# Altium project BEAGLEBONEBLACK.PrjPcb (part 6 of 6)

## Sheet USB_Host.SchDoc
size Letter
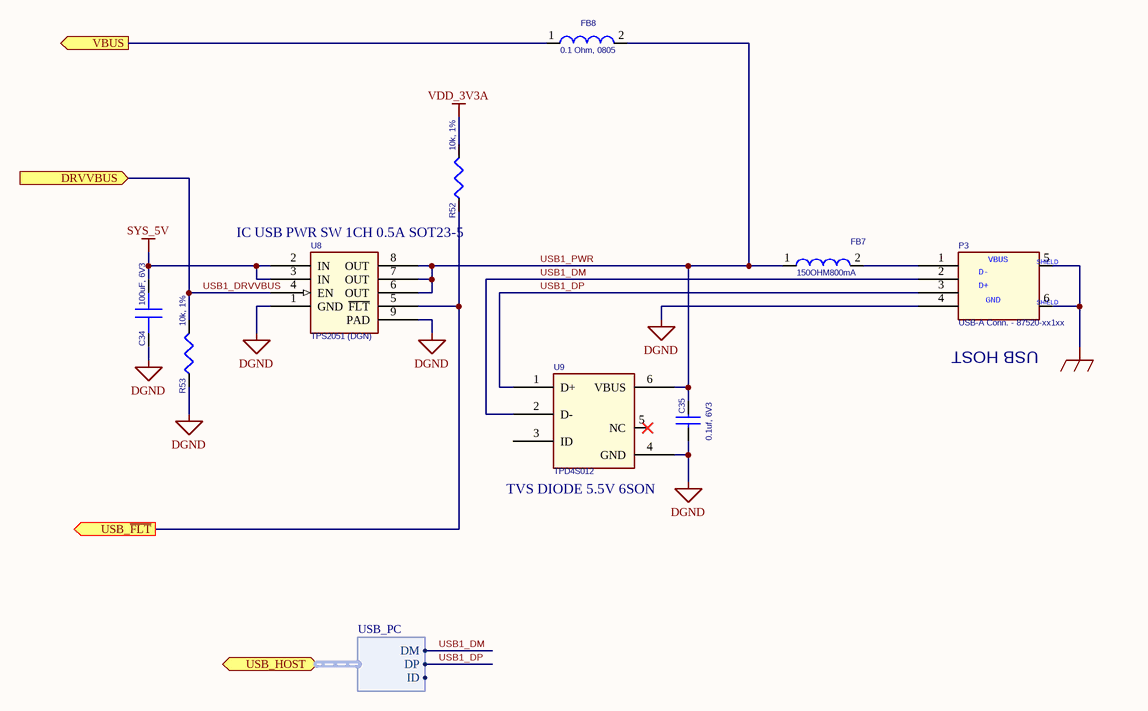
[diagram p19: USB_Host.SchDoc]

### Parts
C34  100uF, 6V3  [RD205SMD_250D]
C35  0.1uf, 6V3  [402]
FB7  150OHM800mA  [SM-7351-IND-0805]
FB8  0.1 Ohm, 0805  [SM-7351-IND-0805]
P3  USB-A Conn. - 87520-xx1xx  [usb_a_sh]
R52  10k, 1%  [402]
R53  10k, 1%  [402]
U8  TPS2051 (DGN)  [DGN-16X60]
U9  TPD4S012  [U_6_DRY]

### Ports
DRVVBUS (in), USB_HOST (harness USB_PC), USB_~{FLT} (out), VBUS (out)

### Harnesses
USB_PC: DM, DP, ID

### Nets
DGND: C34.2 C35.2 P3.4(P4) R53.2(P2) U8.1(GND) U8.9(PAD) U9.4(GND)
GND_EARTH: P3.5(SHELD1) P3.6(PAD4)
SYS_5V: C34.1 U8.2(IN) U8.3(IN)
VDD_3V3A: R52.1(P1)
USB1_DM: P3.2(P2) U9.2(D-) ; port USB_HOST.DM
USB1_DP: P3.3(P3) U9.1(D+) ; port USB_HOST.DP
USB1_DRVVBUS: R53.1(P1) U8.4(EN) ; port DRVVBUS
USB1_PWR: C35.1 FB7.1 FB8.2 U8.6(OUT) U8.7(OUT) U8.8(OUT) U9.6(VBUS)
USB1_VBUS: FB8.1 ; port VBUS
USB_~{FLT}: R52.2(P2) U8.5(~{FLT}) ; port USB_~{FLT}
NetFB7_2: FB7.2 P3.1(P1)

Not connected (* = marked no-connect by the designer): U9 3(ID) 5(NC)*

### Notes on the sheet
- IC USB PWR SW 1CH 0.5A SOT23-5
- (near P3) USB HOST
- (near U9) TVS DIODE 5.5V 6SON
- (in symbol CONN_54819-0578_2) VBUS; SHIELD; D-; D+; GND

### Library data of the parts
C34 = CAP SMD: CAP ALUM 100UF 6.3V 20% SMD; Manufacturer: Cornell Dubilier Electronics (CDE); Manufacturer Part Number: AVE107M06D16T-F; Capacitance: 100µF; Lifetime @ Temp.: 2000 Hrs @ 85°C; Ripple Current: 120mA; ESR (Equivalent Series Resistance): 4.64 Ohm; Surface Mount Land Size: 0.260" L x 0.260" W (6.60mm x 6.60mm); Supplier 1: Digi-Key; Supplier Part Number 1: 338-1787-6-ND; RoHS: RoHS Compliant; Category: Capacitors; Stock 1: 2601; Pricing 1: 1=0.17, 10=0.16, 100=0.133, 250=0.11844, 500=0.0987 (USD); Voltage Rating: 6.3V; Tolerance: ±20%; Operating Temperature: -40°C ~ 85°C; Features: General Purpose; Impedance: -; Mounting Type: Surface Mount; Package / Case: Radial, Can - SMD; Size / Dimension: 0.248" Dia (6.30mm); Height - Seated (Max): 0.209" (5.30mm); Lead Spacing: -; Packaging: Digi-Reel®; ComponentLink1URL: http://www.cde.com/catalogs/AVE.pdf; ComponentLink1Description: http://www.cde.com/catalogs/AVE.pdf
C35 = CAP_0.1uF_X7R_16V_10% 0402: CAP CER 0.1UF 6.3V 10% X5R 0402; Manufacturer: TDK Corporation; Manufacturer Part Number: C1005X5R0J104K050BA; Capacitance: 0.1µF; Supplier 1: Digi-Key; Supplier Part Number 1: 445-1266-6-ND; RoHS: RoHS Compliant; Category: Capacitors; Stock 1: 127604; Pricing 1: 1=0.1, 10=0.026, 100=0.0121, 250=0.00992, 500=0.00848, 1000=0.0066, 5000=0.0055 (USD); Voltage - Rated: 6.3V; Tolerance: ±10%; Temperature Coefficient: X5R; Mounting Type: Surface Mount, MLCC; Operating Temperature: -55°C ~ 85°C; Applications: General Purpose; Ratings: -; Package / Case: 0402 (1005 Metric); Size / Dimension: 0.039" L x 0.020" W (1.00mm x 0.50mm); Height - Seated (Max): -; Thickness (Max): 0.022" (0.55mm); Lead Spacing: -; Features: -; Packaging: Digi-Reel®; Lead Style: -; ComponentLink1URL: http://product.tdk.com/capacitor/mlcc/en/documents/mlcc_commercial_general_en.pdf; ComponentLink1Description: http://product.tdk.com/capacitor/mlcc/en/documents/mlcc_commercial_general_en.pdf
FB7 = FER_180_200_0: FERRITE 800MA 150 OHM 0805 SMD; PartName: FerriteBead150ohm800mA; Mfr: Steward; MfrNum: LI0805H151R-10; TIIntPartnumber: 1L0010; Manufacturer: Laird-Signal Integrity Products; Vendor: Digikey; Impedance @ Frequency: 150 Ohm @ 100MHz; DC Resistance (DCR): 150 mOhm Max; Filter Type: Differential Mode - Single; Supplier 1: Digi-Key; Supplier Part Number 1: 240-2384-6-ND; Manufacturer Part Number: LI0805H151R-10; RoHS: RoHS Compliant; Category: Filters; Stock 1: 3694; Pricing 1: 1=0.1, 10=0.07, 25=0.064, 50=0.0574, 100=0.0421, 250=0.03064, 500=0.02808, 1000=0.02424 (USD); Current Rating: 800mA; Package / Case: 0805 (2012 Metric); Mounting Type: Surface Mount; Packaging: Digi-Reel®; Height (Max): 0.043" (1.10mm); Size / Dimension: 0.079" L x 0.049" W (2.00mm x 1.25mm); ComponentLink1URL: http://www.lairdtech.com/WorkArea/linkit.aspx?LinkIdentifier=id&ItemID=4912; ComponentLink1Description: http://www.lairdtech.com/WorkArea/linkit.aspx?LinkIdentifier=id&ItemID=4912
FB8 = FER_180_200_0: RES .10 OHM 1/8W 5% 0805; Manufacturer: CTS Resistor Products; Manufacturer Part Number: 73L3R10J; Resistance (Ohms): 0.1; Power (Watts): 0.125W, 1/8W; Temperature Coefficient: ±200ppm/°C; Supplier 1: Digi-Key; Supplier Part Number 1: 73L3R10JDKR-ND; RoHS: RoHS Compliant; Category: Resistors; Stock 1: 1186; Pricing 1: 1=0.1, 10=0.066, 100=0.0267, 250=0.0204, 500=0.01632, 1000=0.01201 (USD); Composition: Thick Film; Features: Current Sense; Tolerance: ±5%; Package / Case: 0805 (2012 Metric); Supplier Device Package: 0805; Size / Dimension: 0.079" L x 0.049" W (2.00mm x 1.25mm); Height: 0.026" (0.65mm); Number of Terminations: 2; Packaging: Digi-Reel®; ComponentLink1URL: http://www.ctscorp.com/components/Datasheets/008-0337-0.pdf; ComponentLink1Description: http://www.ctscorp.com/components/Datasheets/008-0337-0.pdf
P3 = CONN_54819-0578_2: CONN RCPT USB TYPE A R/A PCB; Manufacturer: FCI; Manufacturer Part Number: 87520-0010BLF; CLASS: IO; TN: 224-0234-000; Number of Contacts: 4; Gender: Receptacle; Specifications: USB 2.0; Supplier 1: Digi-Key; Supplier Part Number 1: 609-1045-ND; RoHS: RoHS Compliant; Category: Connectors, Interconnects; Stock 1: 4363; Pricing 1: 1=0.78, 10=0.734, 25=0.6604, 50=0.587, 100=0.5626, 250=0.51368, 500=0.4892, 1000=0.40359, 2500=0.3669 (USD); Connector Type: USB - A; Mounting Type: Through Hole, Right Angle, Horizontal; Features: Board Lock; Packaging: Tube; Ingress Protection: -; ComponentLink1URL: http://portal.fciconnect.com/Comergent//fci/drawing/87520.pdf; ComponentLink1Description: http://portal.fciconnect.com/Comergent//fci/drawing/87520.pdf
R52 R53 = RES SMD: RES 10K OHM 1/16W 5% 0402 SMD; Manufacturer: Rohm Semiconductor; Manufacturer Part Number: MCR01MZPJ103; Power (Watts): 0.063W, 1/16W; Temperature Coefficient: ±200ppm/°C; Supplier 1: Digi-Key; Supplier Part Number 1: RHM10KJDKR-ND; RoHS: RoHS Compliant; Category: Resistors; Stock 1: 452072; Pricing 1: 1=0.1, 10=0.019, 25=0.014, 100=0.0078, 250=0.00596, 500=0.00476, 1000=0.0035, 5000=0.00251 (USD); Resistance (Ohms): 10k; Composition: Thick Film; Features: Automotive AEC-Q200 Qualified; Tolerance: ±5%; Package / Case: 0402 (1005 Metric); Supplier Device Package: 0402 (1005 Metric); Size / Dimension: 0.039" L x 0.020" W (1.00mm x 0.50mm); Height: 0.016" (0.40mm); Number of Terminations: 2; Packaging: Digi-Reel®; ComponentLink1URL: http://rohmfs.rohm.com/en/products/databook/datasheet/passive/resistor/chip_resistor/mcr_a.pdf; ComponentLink1Description: http://rohmfs.rohm.com/en/products/databook/datasheet/passive/resistor/chip_resistor/mcr_a.pdf
U8 = TPS2061_0: IC 1.5A PWR DIST SWITCH 8-SOIC; Manufacturer: Texas Instruments; Manufacturer Part Number: TPS2051BDGNR; Number of Outputs: 1; Rds (On): 135 mOhm; Internal Switch(s): Yes; Current Limit: 1A; Voltage - Input: 2.7 V ~ 5.5 V; Supplier 1: Digi-Key; Supplier Part Number 1: 296-17313-6-ND; RoHS: RoHS Compliant; Category: Integrated Circuits (ICs); Stock 1: 7065; Pricing 1: 1=1.82, 10=1.642, 25=1.4708, 100=1.3224, 250=1.1742, 500=1.026, 1000=0.8493 (USD); Type: High Side Switch; Operating Temperature: -40°C ~ 85°C; Mounting Type: Surface Mount; Package / Case: 8-TSSOP, 8-MSOP (0.118", 3.00mm Width) Exposed Pad; Supplier Device Package: 8-MSOP-PowerPad; Packaging: Digi-Reel®; ComponentLink1URL: http://www.ti.com/lit/ds/symlink/tps2051b.pdf; ComponentLink1Description: http://www.ti.com/lit/ds/symlink/tps2051b.pdf
U9 = PROT_TPD4S012: ESD 4channel USB Interface; Mfr: TI; MfrNum: TPD4S012DRY; TIIntPartnumber: 1A0233; Manufacturer: Texas Instruments; Manufacturer Part Number: TPD4S012DRYR; Vendor: Digikey; Cost100: 0.76; Cost10K: 0.23; Power (Watts): 60W; Number of Circuits: 4; PartName: TPD4S012; Supplier 1: Digi-Key; Supplier Part Number 1: 296-24244-6-ND; RoHS: RoHS Compliant; Category: Circuit Protection; Stock 1: 7978; Pricing 1: 1=0.78, 10=0.682, 25=0.6028, 100=0.2552, 250=0.25044, 500=0.2457, 750=0.24097 (USD); Voltage - Working: -; Voltage - Clamping: -; Technology: Mixed Technology; Applications: USB; Package / Case: 6-UFDFN; Supplier Device Package: 6-SON (1.45x1); Packaging: Digi-Reel®; ComponentLink1URL: http://www.ti.com/lit/ds/symlink/tpd4s012.pdf; ComponentLink1Description: http://www.ti.com/lit/ds/symlink/tpd4s012.pdf

## Nets that join several sheets
DDR_VREF: P07_DDR3 Memory (6 pins), P03_Processor 1 of 3, JTAG Header (C28.1 U5.J4)
DGND: Top (S1.1 S1.3 S3.1 S3.3), P02_Power Management (30 pins), P07_DDR3 Memory (42 pins), P10_HDMI Framer (47 pins), P04_Processor 2 or 3, USB and Serial (R49.1 R164.2), P03_Processor 1 of 3, JTAG Header (21 pins), P05_Processor Page 3 of 3 (111 pins), P06_LED, Config, & Button (26 pins), P08_eMMC (15 pins), P09_Ethernet (27 pins), P11_Exp Conn, uSD, and  (8 pins), U_Console (5 pins), SDCARD (C153.2 C154.2 P10.6 P10.9), BoardID (C152.2 U7.2), USB_PC (C36.2 P4.5 U10.4), USB_Host (7 pins)
GND_EARTH: P02_Power Management (MTG1.1 MTG2.1 MTG3.1 MTG4.1), P10_HDMI Framer (P6.20 P6.21 P6.22 P6.23), P09_Ethernet (P5.13 P5.14 R136.2), SDCARD (6 pins), USB_PC (P4.6 P4.7 P4.8 P4.9), USB_Host (P3.5 P3.6)
GNDA_ADC: P04_Processor 2 or 3, USB and Serial (C31.2 C32.2 C33.2 U5.A9), P05_Processor Page 3 of 3 (C93.2 FB3.1 U5.E8), P11_Exp Conn, uSD, and  (P9.34)
SYS_5V: P02_Power Management (14 pins), P10_HDMI Framer (RT1.1), P06_LED, Config, & Button (R71.1 R72.1 R73.1 R74.1), P11_Exp Conn, uSD, and  (P9.7 P9.8), USB_Host (C34.1 U8.2 U8.3)
VDD_1V8: P02_Power Management (C14.2 R9.2 U2.40), P10_HDMI Framer (FB5.2), P05_Processor Page 3 of 3 (9 pins)
VDD_3V3A: P02_Power Management (6 pins), P03_Processor 1 of 3, JTAG Header (9 pins), P05_Processor Page 3 of 3 (42 pins), P06_LED, Config, & Button (16 pins), P09_Ethernet (C5.1 U1.5), U_Console (R2.1 R13.1 R15.1), BoardID (C152.1 R156.1 U7.4), USB_Host (R52.1)
VDD_3V3B: P02_Power Management (C20.1 R11.1 U4.3), P10_HDMI Framer (R158.1 R166.2), P04_Processor 2 or 3, USB and Serial (R163.1), P03_Processor 1 of 3, JTAG Header (C29.1 P2.5 R23.1 R24.1), P08_eMMC (25 pins), P09_Ethernet (7 pins), P11_Exp Conn, uSD, and  (P9.3 P9.4), U_Console (C6.2 C155.2 U15.5 U17.5), SDCARD (10 pins)
VDD_5V: P02_Power Management (C2.2 P1.1 U2.10), P11_Exp Conn, uSD, and  (P9.5 P9.6)
VDD_ADC: P04_Processor 2 or 3, USB and Serial (R27.1), P05_Processor Page 3 of 3 (C93.1 FB2.1 U5.D8), P11_Exp Conn, uSD, and  (P9.32)
VDD_CORE: P02_Power Management (C11.2 L3.2 U2.29), P05_Processor Page 3 of 3 (37 pins)
VDD_MPU: P02_Power Management (C12.2 L2.2 U2.24), P05_Processor Page 3 of 3 (11 pins)
VDDS: P02_Power Management (R8.2 R9.1), P05_Processor Page 3 of 3 (13 pins)
VDDS_DDR: P02_Power Management (C9.2 R6.2), P07_DDR3 Memory (36 pins), P05_Processor Page 3 of 3 (16 pins)
VIO: P02_Power Management (R7.2 U2.18), P03_Processor 1 of 3, JTAG Header (U16.5)
VRTC: P02_Power Management (C16.1 R5.2), P04_Processor 2 or 3, USB and Serial (R26.1), P05_Processor Page 3 of 3 (C105.1 U5.D7)
12MHZ: P10_HDMI Framer (U11.27), P03_Processor 1 of 3, JTAG Header (R21.2)
AIN0: P04_Processor 2 or 3, USB and Serial (U5.B6), P11_Exp Conn, uSD, and  (P9.39)
AIN1: P04_Processor 2 or 3, USB and Serial (U5.C7), P11_Exp Conn, uSD, and  (P9.40)
AIN2: P04_Processor 2 or 3, USB and Serial (U5.B7), P11_Exp Conn, uSD, and  (P9.37)
AIN3: P04_Processor 2 or 3, USB and Serial (U5.A7), P11_Exp Conn, uSD, and  (P9.38)
AIN4: P04_Processor 2 or 3, USB and Serial (U5.C8), P11_Exp Conn, uSD, and  (P9.33)
AIN5: P04_Processor 2 or 3, USB and Serial (U5.B8), P11_Exp Conn, uSD, and  (P9.36)
AIN6: P04_Processor 2 or 3, USB and Serial (U5.A8), P11_Exp Conn, uSD, and  (P9.35)
DDR_A0: P07_DDR3 Memory (U12.N3), P03_Processor 1 of 3, JTAG Header (U5.F3)
DDR_A1: P07_DDR3 Memory (U12.P7), P03_Processor 1 of 3, JTAG Header (U5.H1)
DDR_A2: P07_DDR3 Memory (U12.P3), P03_Processor 1 of 3, JTAG Header (U5.E4)
DDR_A3: P07_DDR3 Memory (U12.N2), P03_Processor 1 of 3, JTAG Header (U5.C3)
DDR_A4: P07_DDR3 Memory (U12.P8), P03_Processor 1 of 3, JTAG Header (U5.C2)
DDR_A5: P07_DDR3 Memory (U12.P2), P03_Processor 1 of 3, JTAG Header (U5.B1)
DDR_A6: P07_DDR3 Memory (U12.R8), P03_Processor 1 of 3, JTAG Header (U5.D5)
DDR_A7: P07_DDR3 Memory (U12.R2), P03_Processor 1 of 3, JTAG Header (U5.E2)
DDR_A8: P07_DDR3 Memory (U12.T8), P03_Processor 1 of 3, JTAG Header (U5.D4)
DDR_A9: P07_DDR3 Memory (U12.R3), P03_Processor 1 of 3, JTAG Header (U5.C1)
DDR_A10: P07_DDR3 Memory (U12.L7), P03_Processor 1 of 3, JTAG Header (U5.F4)
DDR_A11: P07_DDR3 Memory (U12.R7), P03_Processor 1 of 3, JTAG Header (U5.F2)
DDR_A12: P07_DDR3 Memory (U12.N7), P03_Processor 1 of 3, JTAG Header (U5.E3)
DDR_A13: P07_DDR3 Memory (U12.T3), P03_Processor 1 of 3, JTAG Header (U5.H3)
DDR_A14: P07_DDR3 Memory (U12.T7), P03_Processor 1 of 3, JTAG Header (U5.H4)
DDR_A15: P07_DDR3 Memory (U12.M7), P03_Processor 1 of 3, JTAG Header (U5.D3)
DDR_BA0: P07_DDR3 Memory (U12.M2), P03_Processor 1 of 3, JTAG Header (U5.C4)
DDR_BA1: P07_DDR3 Memory (U12.N8), P03_Processor 1 of 3, JTAG Header (U5.E1)
DDR_BA2: P07_DDR3 Memory (U12.M3), P03_Processor 1 of 3, JTAG Header (U5.B3)
DDR_CASn: P07_DDR3 Memory (U12.K3), P03_Processor 1 of 3, JTAG Header (U5.F1)
DDR_CKE: P07_DDR3 Memory (R96.2 U12.K9), P03_Processor 1 of 3, JTAG Header (U5.G3)
DDR_CLK: P07_DDR3 Memory (U12.J7), P03_Processor 1 of 3, JTAG Header (U5.D2)
DDR_CLKn: P07_DDR3 Memory (U12.K7), P03_Processor 1 of 3, JTAG Header (U5.D1)
DDR_CSn: P07_DDR3 Memory (U12.L2), P03_Processor 1 of 3, JTAG Header (U5.H2)
DDR_D0: P07_DDR3 Memory (U12.E3), P03_Processor 1 of 3, JTAG Header (U5.M3)
DDR_D1: P07_DDR3 Memory (U12.F7), P03_Processor 1 of 3, JTAG Header (U5.M4)
DDR_D2: P07_DDR3 Memory (U12.F2), P03_Processor 1 of 3, JTAG Header (U5.N1)
DDR_D3: P07_DDR3 Memory (U12.F8), P03_Processor 1 of 3, JTAG Header (U5.N2)
DDR_D4: P07_DDR3 Memory (U12.H3), P03_Processor 1 of 3, JTAG Header (U5.N3)
DDR_D5: P07_DDR3 Memory (U12.H8), P03_Processor 1 of 3, JTAG Header (U5.N4)
DDR_D6: P07_DDR3 Memory (U12.G2), P03_Processor 1 of 3, JTAG Header (U5.P3)
DDR_D7: P07_DDR3 Memory (U12.H7), P03_Processor 1 of 3, JTAG Header (U5.P4)
DDR_D8: P07_DDR3 Memory (U12.D7), P03_Processor 1 of 3, JTAG Header (U5.J1)
DDR_D9: P07_DDR3 Memory (U12.C3), P03_Processor 1 of 3, JTAG Header (U5.K1)
DDR_D10: P07_DDR3 Memory (U12.C8), P03_Processor 1 of 3, JTAG Header (U5.K2)
DDR_D11: P07_DDR3 Memory (U12.C2), P03_Processor 1 of 3, JTAG Header (U5.K3)
DDR_D12: P07_DDR3 Memory (U12.A7), P03_Processor 1 of 3, JTAG Header (U5.K4)
DDR_D13: P07_DDR3 Memory (U12.A2), P03_Processor 1 of 3, JTAG Header (U5.L3)
DDR_D14: P07_DDR3 Memory (U12.B8), P03_Processor 1 of 3, JTAG Header (U5.L4)
DDR_D15: P07_DDR3 Memory (U12.A3), P03_Processor 1 of 3, JTAG Header (U5.M1)
DDR_DQM0: P07_DDR3 Memory (U12.E7), P03_Processor 1 of 3, JTAG Header (U5.M2)
DDR_DQM1: P07_DDR3 Memory (U12.D3), P03_Processor 1 of 3, JTAG Header (U5.J2)
DDR_DQS0: P07_DDR3 Memory (U12.F3), P03_Processor 1 of 3, JTAG Header (U5.P1)
DDR_DQS1: P07_DDR3 Memory (U12.C7), P03_Processor 1 of 3, JTAG Header (U5.L1)
DDR_DQSN0: P07_DDR3 Memory (U12.G3), P03_Processor 1 of 3, JTAG Header (U5.P2)
DDR_DQSN1: P07_DDR3 Memory (U12.B7), P03_Processor 1 of 3, JTAG Header (U5.L2)
DDR_ODT: P07_DDR3 Memory (U12.K1), P03_Processor 1 of 3, JTAG Header (U5.G1)
DDR_RASn: P07_DDR3 Memory (U12.J3), P03_Processor 1 of 3, JTAG Header (U5.G4)
DDR_RESETn: P07_DDR3 Memory (R97.2 U12.T2), P03_Processor 1 of 3, JTAG Header (U5.G2)
DDR_WEn: P07_DDR3 Memory (U12.L3), P03_Processor 1 of 3, JTAG Header (U5.B2)
eMMC_RSTn: P03_Processor 1 of 3, JTAG Header (R162.2), P08_eMMC (R111.2 U13.K5)
GPIO0_7: P04_Processor 2 or 3, USB and Serial (R50.1 R51.1), P11_Exp Conn, uSD, and  (P9.42)
GPIO0_22/EHRPWM2A: P03_Processor 1 of 3, JTAG Header (U5.U10), P11_Exp Conn, uSD, and  (P8.19)
GPIO0_23/EHRPWM2B: P03_Processor 1 of 3, JTAG Header (U5.T10), P11_Exp Conn, uSD, and  (P8.13)
GPIO0_26: P03_Processor 1 of 3, JTAG Header (U5.T11), P11_Exp Conn, uSD, and  (P8.14)
GPIO0_27: P03_Processor 1 of 3, JTAG Header (U5.U12), P11_Exp Conn, uSD, and  (P8.17)
GPIO1_12: P03_Processor 1 of 3, JTAG Header (U5.T12), P11_Exp Conn, uSD, and  (P8.12)
GPIO1_13: P03_Processor 1 of 3, JTAG Header (U5.R12), P11_Exp Conn, uSD, and  (P8.11)
GPIO1_14: P03_Processor 1 of 3, JTAG Header (U5.V13), P11_Exp Conn, uSD, and  (P8.16)
GPIO1_15: P03_Processor 1 of 3, JTAG Header (U5.U13), P11_Exp Conn, uSD, and  (P8.15)
GPIO1_16: P03_Processor 1 of 3, JTAG Header (R160.2 R161.2), P11_Exp Conn, uSD, and  (P9.15)
GPIO1_17: P03_Processor 1 of 3, JTAG Header (U5.V14), P11_Exp Conn, uSD, and  (P9.23)
GPIO1_18/EHRPWM1A: P03_Processor 1 of 3, JTAG Header (U5.U14), P11_Exp Conn, uSD, and  (P9.14)
GPIO1_19/EHRPWM1B: P03_Processor 1 of 3, JTAG Header (U5.T14), P11_Exp Conn, uSD, and  (P9.16)
GPIO1_28: P03_Processor 1 of 3, JTAG Header (U5.U18), P11_Exp Conn, uSD, and  (P9.12)
GPIO1_29: P03_Processor 1 of 3, JTAG Header (U5.V6), P11_Exp Conn, uSD, and  (P8.26)
GPIO2_1: P03_Processor 1 of 3, JTAG Header (U5.V12), P11_Exp Conn, uSD, and  (P8.18)
GPIO3_19: P04_Processor 2 or 3, USB and Serial (U5.C13), P11_Exp Conn, uSD, and  (P9.27)
GPIO3_21: P04_Processor 2 or 3, USB and Serial (U5.A14), P11_Exp Conn, uSD, and  (P9.25)
HDMI_INT: P10_HDMI Framer (R158.2 U11.50), P03_Processor 1 of 3, JTAG Header (U5.U16)
I2C0_SCL: P02_Power Management (R3.2 U2.28), P10_HDMI Framer (U11.52), P04_Processor 2 or 3, USB and Serial (U5.C16), BoardID (U7.1)
I2C0_SDA: P02_Power Management (R4.2 U2.27), P10_HDMI Framer (U11.51), P04_Processor 2 or 3, USB and Serial (U5.C17), BoardID (U7.3)
I2C1_SCL/SPI0CS: P04_Processor 2 or 3, USB and Serial (U5.A16), P11_Exp Conn, uSD, and  (P9.17)
I2C1_SDA/SPI0MISO: P04_Processor 2 or 3, USB and Serial (U5.B16), P11_Exp Conn, uSD, and  (P9.18)
I2C2_SCL: P04_Processor 2 or 3, USB and Serial (U5.D17), P11_Exp Conn, uSD, and  (P9.19)
I2C2_SDA: P04_Processor 2 or 3, USB and Serial (U5.D18), P11_Exp Conn, uSD, and  (P9.20)
LCD_DATA0: P10_HDMI Framer (C173.1 U11.15), P04_Processor 2 or 3, USB and Serial (U5.R1), P06_LED, Config, & Button (R70.2 R95.1), P11_Exp Conn, uSD, and  (P8.45)
LCD_DATA1: P10_HDMI Framer (C171.1 U11.13), P04_Processor 2 or 3, USB and Serial (U5.R2), P06_LED, Config, & Button (R69.2 R94.1), P11_Exp Conn, uSD, and  (P8.46)
LCD_DATA2: P10_HDMI Framer (C172.1 U11.12), P04_Processor 2 or 3, USB and Serial (U5.R3), P06_LED, Config, & Button (R68.2 R75.1 R93.1), P11_Exp Conn, uSD, and  (P8.43)
LCD_DATA3: P10_HDMI Framer (C170.1 U11.11), P04_Processor 2 or 3, USB and Serial (U5.R4), P06_LED, Config, & Button (R67.2 R92.1), P11_Exp Conn, uSD, and  (P8.44)
LCD_DATA4: P10_HDMI Framer (C169.1 U11.10), P04_Processor 2 or 3, USB and Serial (U5.T1), P06_LED, Config, & Button (R66.2 R91.1), P11_Exp Conn, uSD, and  (P8.41)
LCD_DATA5: P10_HDMI Framer (C163.1 U11.7), P04_Processor 2 or 3, USB and Serial (U5.T2), P06_LED, Config, & Button (R65.2 R90.1), P11_Exp Conn, uSD, and  (P8.42)
LCD_DATA6: P10_HDMI Framer (C162.1 U11.6), P04_Processor 2 or 3, USB and Serial (U5.T3), P06_LED, Config, & Button (R64.2 R89.1), P11_Exp Conn, uSD, and  (P8.39)
LCD_DATA7: P10_HDMI Framer (C161.1 U11.3), P04_Processor 2 or 3, USB and Serial (U5.T4), P06_LED, Config, & Button (R63.2 R88.1), P11_Exp Conn, uSD, and  (P8.40)
LCD_DATA8: P10_HDMI Framer (C160.1 U11.2), P04_Processor 2 or 3, USB and Serial (U5.U1), P06_LED, Config, & Button (R62.2 R87.1), P11_Exp Conn, uSD, and  (P8.37)
LCD_DATA9: P10_HDMI Framer (C157.1 U11.1), P04_Processor 2 or 3, USB and Serial (U5.U2), P06_LED, Config, & Button (R61.2 R86.1), P11_Exp Conn, uSD, and  (P8.38)
LCD_DATA10: P10_HDMI Framer (C156.1 U11.64), P04_Processor 2 or 3, USB and Serial (U5.U3), P06_LED, Config, & Button (R60.2 R85.1), P11_Exp Conn, uSD, and  (P8.36)
LCD_DATA11: P10_HDMI Framer (C168.1 U11.60), P04_Processor 2 or 3, USB and Serial (U5.U4), P06_LED, Config, & Button (R59.2 R84.1), P11_Exp Conn, uSD, and  (P8.34)
LCD_DATA12: P10_HDMI Framer (C167.1 U11.59), P04_Processor 2 or 3, USB and Serial (U5.V2), P06_LED, Config, & Button (R58.2 R83.1), P11_Exp Conn, uSD, and  (P8.35)
LCD_DATA13: P10_HDMI Framer (C166.1 U11.58), P04_Processor 2 or 3, USB and Serial (U5.V3), P06_LED, Config, & Button (R57.2 R82.1), P11_Exp Conn, uSD, and  (P8.33)
LCD_DATA14: P10_HDMI Framer (C165.1 U11.57), P04_Processor 2 or 3, USB and Serial (U5.V4), P06_LED, Config, & Button (R56.2 R81.1), P11_Exp Conn, uSD, and  (P8.31)
LCD_DATA15: P10_HDMI Framer (C164.1 U11.56), P04_Processor 2 or 3, USB and Serial (U5.T5), P06_LED, Config, & Button (R55.2 R80.1), P11_Exp Conn, uSD, and  (P8.32)
LCD_DE: P10_HDMI Framer (U11.20), P04_Processor 2 or 3, USB and Serial (R48.2), P11_Exp Conn, uSD, and  (P8.30)
LCD_HSYNC: P10_HDMI Framer (U11.22), P04_Processor 2 or 3, USB and Serial (R47.2), P11_Exp Conn, uSD, and  (P8.29)
LCD_PCLK: P10_HDMI Framer (U11.4), P04_Processor 2 or 3, USB and Serial (R45.2), P11_Exp Conn, uSD, and  (P8.28)
LCD_VSYNC: P10_HDMI Framer (U11.21), P04_Processor 2 or 3, USB and Serial (R46.2), P11_Exp Conn, uSD, and  (P8.27)
LDO_PGOOD: P02_Power Management (U2.46), P03_Processor 1 of 3, JTAG Header (U5.B5)
MDIO_CLK: P04_Processor 2 or 3, USB and Serial (U5.M18), P09_Ethernet (U14.17)
MDIO_DATA: P04_Processor 2 or 3, USB and Serial (U5.M17), P09_Ethernet (R119.2 U14.16)
MII1_COL: P04_Processor 2 or 3, USB and Serial (U5.H16), P09_Ethernet (R138.1)
MII1_CRS_DV: P04_Processor 2 or 3, USB and Serial (U5.H17), P09_Ethernet (R139.1)
MII1_REFCLK: P04_Processor 2 or 3, USB and Serial (R28.2), P09_Ethernet (R124.1 R140.1)
MII1_RXCLK: P04_Processor 2 or 3, USB and Serial (U5.L18), P09_Ethernet (R131.1)
MII1_RXD0: P04_Processor 2 or 3, USB and Serial (U5.M16), P09_Ethernet (R128.1)
MII1_RXD1: P04_Processor 2 or 3, USB and Serial (U5.L15), P09_Ethernet (R127.1)
MII1_RXD2: P04_Processor 2 or 3, USB and Serial (U5.L16), P09_Ethernet (R126.1)
MII1_RXD3: P04_Processor 2 or 3, USB and Serial (U5.L17), P09_Ethernet (R125.1)
MII1_RXDV: P04_Processor 2 or 3, USB and Serial (U5.J17), P09_Ethernet (R129.1)
MII1_RXERR: P04_Processor 2 or 3, USB and Serial (U5.J15), P09_Ethernet (R133.1)
MII1_TXCLK: P04_Processor 2 or 3, USB and Serial (U5.K18), P09_Ethernet (R134.1)
MII1_TXD0: P04_Processor 2 or 3, USB and Serial (U5.K17), P09_Ethernet (U14.22)
MII1_TXD1: P04_Processor 2 or 3, USB and Serial (U5.K16), P09_Ethernet (U14.23)
MII1_TXD2: P04_Processor 2 or 3, USB and Serial (U5.K15), P09_Ethernet (U14.24)
MII1_TXD3: P04_Processor 2 or 3, USB and Serial (U5.J18), P09_Ethernet (U14.25)
MII1_TXEN: P04_Processor 2 or 3, USB and Serial (U5.J16), P09_Ethernet (U14.21)
MMC0_CD: P04_Processor 2 or 3, USB and Serial (U5.C15), P03_Processor 1 of 3, JTAG Header (P2.19), SDCARD (P10.10 R157.1)
MMC0_CLKO: P03_Processor 1 of 3, JTAG Header (U5.G17), SDCARD (P10.5 R152.2)
MMC0_CMD: P03_Processor 1 of 3, JTAG Header (U5.G18), SDCARD (P10.3 R151.2)
MMC0_DAT0: P03_Processor 1 of 3, JTAG Header (U5.G16), SDCARD (P10.7 R153.2)
MMC0_DAT1: P03_Processor 1 of 3, JTAG Header (U5.G15), SDCARD (P10.8 R154.2)
MMC0_DAT2: P03_Processor 1 of 3, JTAG Header (U5.F18), SDCARD (P10.1 R150.2)
MMC0_DAT3: P03_Processor 1 of 3, JTAG Header (U5.F17), SDCARD (P10.2 R155.2)
MMC1_CLK: P03_Processor 1 of 3, JTAG Header (U5.U9), P08_eMMC (R110.2 U13.M6), P11_Exp Conn, uSD, and  (P8.21)
MMC1_CMD: P03_Processor 1 of 3, JTAG Header (U5.V9), P08_eMMC (R109.2 U13.M5), P11_Exp Conn, uSD, and  (P8.20)
MMC1_DAT0: P03_Processor 1 of 3, JTAG Header (U5.U7), P08_eMMC (R101.2 U13.A3), P11_Exp Conn, uSD, and  (P8.25)
MMC1_DAT1: P03_Processor 1 of 3, JTAG Header (U5.V7), P08_eMMC (R102.2 U13.A4), P11_Exp Conn, uSD, and  (P8.24)
MMC1_DAT2: P03_Processor 1 of 3, JTAG Header (U5.R8), P08_eMMC (R103.2 U13.A5), P11_Exp Conn, uSD, and  (P8.5)
MMC1_DAT3: P03_Processor 1 of 3, JTAG Header (U5.T8), P08_eMMC (R104.2 U13.B2), P11_Exp Conn, uSD, and  (P8.6)
MMC1_DAT4: P03_Processor 1 of 3, JTAG Header (U5.U8), P08_eMMC (R105.2 U13.B3), P11_Exp Conn, uSD, and  (P8.23)
MMC1_DAT5: P03_Processor 1 of 3, JTAG Header (U5.V8), P08_eMMC (R106.2 U13.B4), P11_Exp Conn, uSD, and  (P8.22)
MMC1_DAT6: P03_Processor 1 of 3, JTAG Header (U5.R9), P08_eMMC (R107.2 U13.B5), P11_Exp Conn, uSD, and  (P8.3)
MMC1_DAT7: P03_Processor 1 of 3, JTAG Header (U5.T9), P08_eMMC (R108.2 U13.B6), P11_Exp Conn, uSD, and  (P8.4)
NetC1_2: P02_Power Management (C1.2 U2.12), USB_PC (C36.1 P4.1 U10.6)
PMIC_INT: P02_Power Management (R1.2 U2.45), P03_Processor 1 of 3, JTAG Header (U5.B18)
PMIC_PGOOD: P02_Power Management (U2.26), P03_Processor 1 of 3, JTAG Header (U5.B15 U16.2)
PMIC_POWR_EN: P02_Power Management (U2.9), P04_Processor 2 or 3, USB and Serial (U5.C6)
PWR_BUT: P02_Power Management (U2.25), P11_Exp Conn, uSD, and  (P9.9)
SPI1_CS0: P10_HDMI Framer (U11.25), P04_Processor 2 or 3, USB and Serial (U5.C12), P11_Exp Conn, uSD, and  (P9.28)
SPI1_D0: P10_HDMI Framer (U11.24), P04_Processor 2 or 3, USB and Serial (U5.B13), P11_Exp Conn, uSD, and  (P9.29)
SPI1_D1: P04_Processor 2 or 3, USB and Serial (U5.D12), P11_Exp Conn, uSD, and  (P9.30)
SPI1_SCLK: P10_HDMI Framer (U11.23), P04_Processor 2 or 3, USB and Serial (U5.A13), P11_Exp Conn, uSD, and  (P9.31)
SYS_RESETn: P03_Processor 1 of 3, JTAG Header (6 pins), P09_Ethernet (U1.4 U14.19), P11_Exp Conn, uSD, and  (P9.10)
TIMER4: P03_Processor 1 of 3, JTAG Header (U5.R7), P11_Exp Conn, uSD, and  (P8.7)
TIMER5: P03_Processor 1 of 3, JTAG Header (U5.T6), P11_Exp Conn, uSD, and  (P8.9)
TIMER6: P03_Processor 1 of 3, JTAG Header (U5.U6), P11_Exp Conn, uSD, and  (P8.10)
TIMER7: P03_Processor 1 of 3, JTAG Header (U5.T7), P11_Exp Conn, uSD, and  (P8.8)
UART0_RX: P04_Processor 2 or 3, USB and Serial (U5.E15), U_Console (R2.2 U15.4)
UART0_TX: P04_Processor 2 or 3, USB and Serial (U5.E16), U_Console (R13.2 U17.2)
UART1_RXD/CAN1TX: P04_Processor 2 or 3, USB and Serial (U5.D16), P11_Exp Conn, uSD, and  (P9.26)
UART1_TXD/CAN1RX: P04_Processor 2 or 3, USB and Serial (U5.D15), P11_Exp Conn, uSD, and  (P9.24)
UART2_RXD/SPI0SCLK: P04_Processor 2 or 3, USB and Serial (U5.A17), P11_Exp Conn, uSD, and  (P9.22)
UART2_TXD/SPI0MOSI: P04_Processor 2 or 3, USB and Serial (U5.B17), P11_Exp Conn, uSD, and  (P9.21)
UART4_RXD: P03_Processor 1 of 3, JTAG Header (U5.T17), P11_Exp Conn, uSD, and  (P9.11)
UART4_TXD: P03_Processor 1 of 3, JTAG Header (U5.U17), P11_Exp Conn, uSD, and  (P9.13)
USB0_DM: P04_Processor 2 or 3, USB and Serial (U5.N18), USB_PC (P4.2 U10.2)
USB0_DP: P04_Processor 2 or 3, USB and Serial (U5.N17), USB_PC (P4.3 U10.1)
USB0_ID: P04_Processor 2 or 3, USB and Serial (U5.P16), USB_PC (P4.4 U10.3)
USB1_DM: P04_Processor 2 or 3, USB and Serial (U5.R18), USB_Host (P3.2 U9.2)
USB1_DP: P04_Processor 2 or 3, USB and Serial (U5.R17), USB_Host (P3.3 U9.1)
USB1_DRVVBUS: P04_Processor 2 or 3, USB and Serial (U5.F15), USB_Host (R53.1 U8.4)
USB1_VBUS: P04_Processor 2 or 3, USB and Serial (U5.T18), USB_Host (FB8.1)
USB_~{FLT}: P03_Processor 1 of 3, JTAG Header (U5.T16), USB_Host (R52.2 U8.5)
USR0: P03_Processor 1 of 3, JTAG Header (U5.V15), P06_LED, Config, & Button (Q1.2 R76.1)
USR1: P03_Processor 1 of 3, JTAG Header (U5.U15), P06_LED, Config, & Button (Q1.5 R77.1)
USR2: P03_Processor 1 of 3, JTAG Header (U5.T15), P06_LED, Config, & Button (Q2.2 R78.1)
USR3: P03_Processor 1 of 3, JTAG Header (U5.V16), P06_LED, Config, & Button (Q2.5 R79.1)
WAKEUP: P02_Power Management (U2.13), P04_Processor 2 or 3, USB and Serial (R26.2 U5.C5)

## Assembly variants
Default: not fitted C137 C138 C139 C140 P2 R9 R57 R58 R59 R60 R61 R62 R63 R64 R69 R70 R81 R90 R91 R92 R93 R124 R140 R141